# Altium schematic sheet Right_Power.SchDoc: Power Management (part 1 of 3)
size A4; Author: Parth Thakkar; CompanyName: Insane Corp; Organization: Low Self Esteam; Revision: v1.0; SheetNumber: 6; SheetTotal: 8
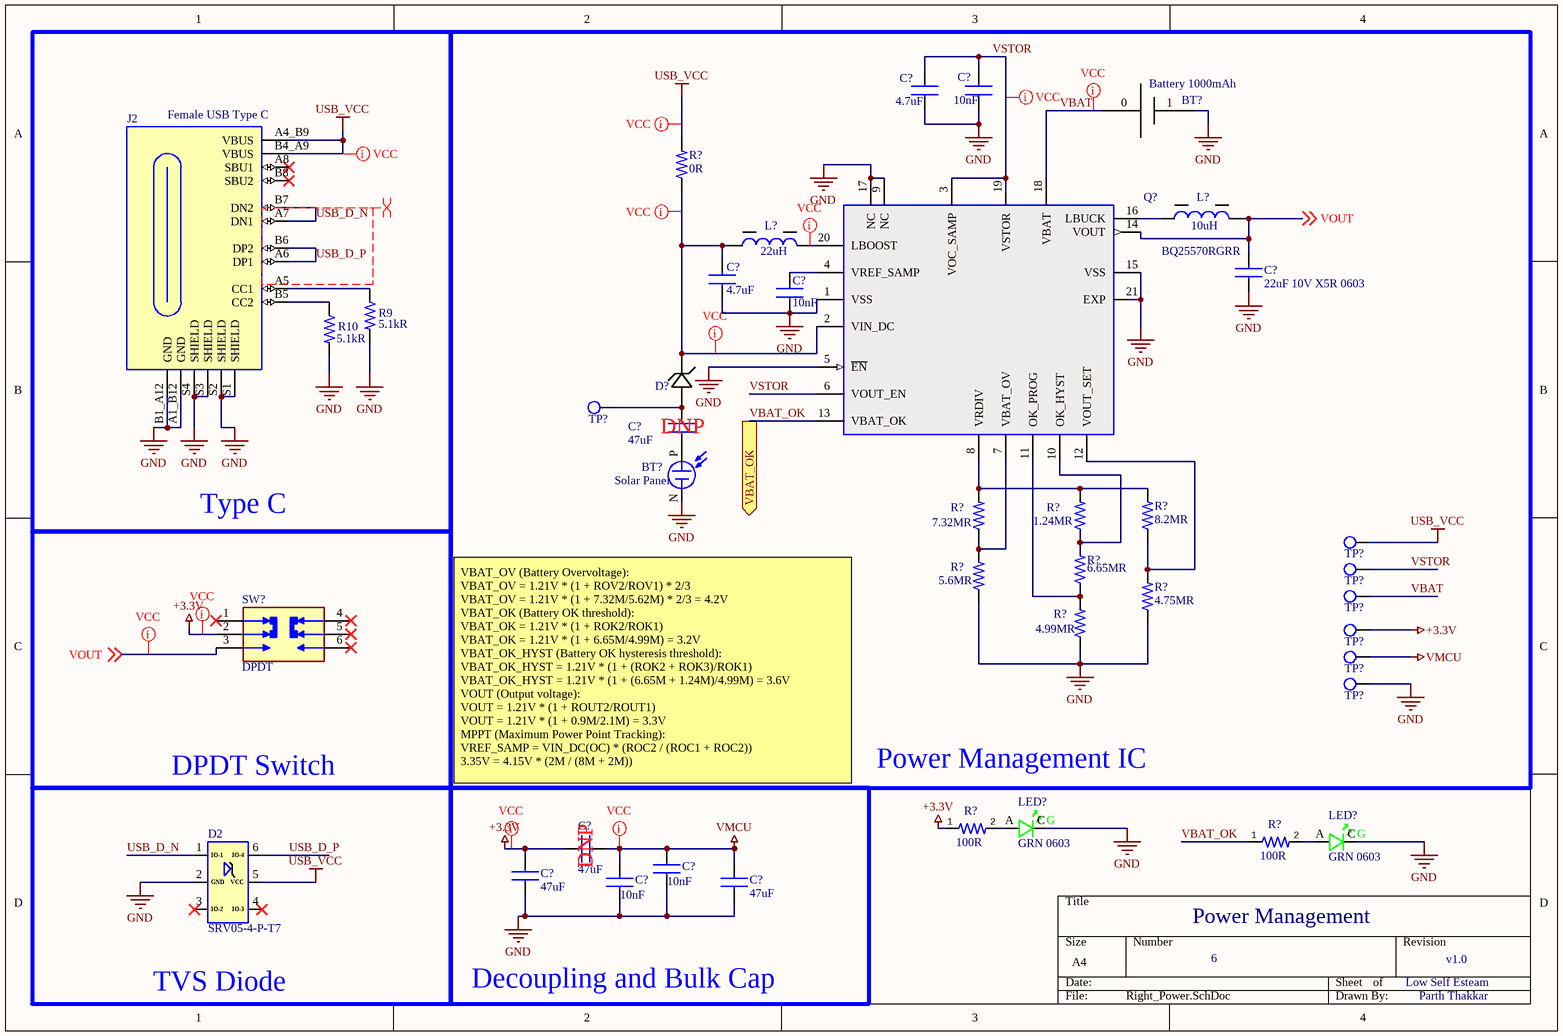
[diagram p0: Right_Power.SchDoc]

## Parts
(Parts that share a designator on the sheet are numbered #1, #2 ... from top to bottom, then left to right.)
BT?#1  Battery 1000mAh  [Battery]
BT?#2  Solar Panel  [Solar panel]
C?#1  value 4.7uF  [Capacitor 0603]  (hidden comment: CAP 4.7uF 25V 0603)
C?#2  value 10nF  [Capacitor 0603]  (hidden comment: CAP 10nF 100V 0603)
C?#3  22uF 10V X5R 0603  [Capacitor 0603]
C?#4  value 4.7uF  [Capacitor 0603]  (hidden comment: CAP 4.7uF 25V 0603)
C?#5  value 10nF  [Capacitor 0603]  (hidden comment: CAP 10nF 100V 0603)
C?#6  value 47uF  [CAPACITOR 0805]  (hidden comment: CAP 47uF 10V 0805)  (net tie, no BOM)
C?#7  value 47uF  [CAPACITOR 0805]  (hidden comment: CAP 47uF 10V 0805)  (net tie, no BOM)
C?#8  value 10nF  [Capacitor 0603]  (hidden comment: CAP 0.1uF 100V 0603)
C?#9  value 47uF  [Capacitor 0805]  (hidden comment: CAP 47uF 10V 0805)
C?#10  value 10nF  [Capacitor 0603]  (hidden comment: CAP 0.1uF 100V 0603)
C?#11  value 47uF  [Capacitor 0805]  (hidden comment: CAP 47uF 10V 0805)
D2  SRV05-4-P-T7  [TVS]
D?  Diode Schottky  [Diode Schottky]  (value not drawn)
J2  Female USB Type C  [Type C]
L?#1  Inductance-Nom (L): 10uH  [IND 10uH (1x3.2)]  (hidden comment: IND 10uH 1111)
L?#2  Inductance-Nom (L): 22uH  [IND 22uH (1.6x4.3)]  (hidden comment: IND 22uH 1515)
LED?#1  GRN 0603  [LED 0603]
LED?#2  GRN 0603  [LED 0603]
Q?  BQ25570RGRR  [BQ25570RGRR]
R9  value 5.1kR  [Resistor 0603]  (hidden comment: RES 5.1K 0603)
R10  value 5.1kR  [Resistor 0603]  (hidden comment: RES 5.1K 0603)
R?#1  value 0R  [Resistor 0402]  (hidden comment: RES 0R 0402)
R?#2  value 7.32MR  [Resistor 0603]  (hidden comment: RES 7.32M 0603)
R?#3  value 1.24MR  [Resistor 0603]  (hidden comment: RES 1.24M 0603)
R?#4  value 8.2MR  [Resistor 0603]  (hidden comment: RES 8.2M 0603)
R?#5  value 6.65MR  [Resistor 0603]  (hidden comment: RES 6.65M 0603)
R?#6  value 5.6MR  [Resistor 0603]  (hidden comment: RES 5.62M 0603)
R?#7  value 4.75MR  [Resistor 0603]  (hidden comment: RES 4.75M 0603)
R?#8  value 4.99MR  [Resistor 0603]  (hidden comment: RES 4.99M 0603)
R?#9  value 100R  [Resistor 0603]  (hidden comment: RES 100R 0603)
R?#10  value 100R  [Resistor 0603]  (hidden comment: RES 100R 0603)
SW?  DPDT  [DPDT]
TP?#1  Test Point  [Test point]  (value not drawn)  (no BOM)
TP?#2  Test point  [Test Point]  (value not drawn)  (no BOM)
TP?#3  Test point  [Test Point]  (value not drawn)  (no BOM)
TP?#4  Test point  [Test Point]  (value not drawn)  (no BOM)
TP?#5  Test point  [Test Point]  (value not drawn)  (no BOM)
TP?#6  Test point  [Test Point]  (value not drawn)  (no BOM)
TP?#7  Test point  [Test Point]  (value not drawn)  (no BOM)

## Blocks framed on the sheet
Type C: J2 R9 R10
Power Management IC: BT?#1 BT?#2 C?#1-C?#6 D? L?#1 L?#2 Q? R?#1-R?#8 TP?#1-TP?#7
Decoupling and Bulk Cap: C?#7-C?#11

## Ports
VBAT_OK (out, see 1[2C], 4[3B])

## Nets
+3.3V: C?#7.1 C?#9.1 R?#9.1 SW?.2 TP?#5.1
GND: BT?#1.1(GND) BT?#2.N C?#1.2 C?#2.2 C?#3.2 C?#4.2 C?#5.1 C?#8.2 C?#9.2 C?#10.2 C?#11.2 D2.2(GND) J2.A1_B12(GND) J2.B1_A12(GND) J2.S1(SHIELD) J2.S2(SHIELD) J2.S3(SHIELD) J2.S4(SHIELD) LED?#1.C LED?#2.C Q?.1(VSS) Q?.5(~{EN}) Q?.9(NC) Q?.15(VSS) Q?.17(NC) Q?.21(EXP) R9.2 R10.2 R?#6.1 R?#7.1 R?#8.1 TP?#7.1
USB_VCC: D2.5(VCC) J2.A4_B9(VBUS) J2.B4_A9(VBUS) R?#1.2 TP?#2.1
VMCU: C?#7.2 C?#8.1 C?#10.1 C?#11.1 TP?#6.1
USB_D_N: D2.1(IO-1) J2.A7(DN1) J2.B7(DN2)
USB_D_P: D2.6(IO-4) J2.A6(DP1) J2.B6(DP2)
VBAT: BT?#1.0(VCC) Q?.18(VBAT) TP?#4.1
VBAT_OK: Q?.13(VBAT_OK) R?#10.1 ; port VBAT_OK
VOUT: C?#3.1 L?#1.2 Q?.14(VOUT) SW?.3 ; off-sheet VOUT
VSTOR: C?#1.1 C?#2.1 Q?.3(VOC_SAMP) Q?.6(VOUT_EN) Q?.19(VSTOR) TP?#3.1
NetBT?#2_P: BT?#2.P C?#6.2
NetC?#4_1: C?#4.1 D?.1 L?#2.1 Q?.2(VIN_DC) R?#1.1
NetC?#5_2: C?#5.2 Q?.4(VREF_SAMP)
NetC?#6_1: C?#6.1 D?.2 TP?#1.1
NetJ2_A5: J2.A5(CC1) R9.1
NetJ2_B5: J2.B5(CC2) R10.1
NetL?#1_1: L?#1.1 Q?.16(LBUCK)
NetL?#2_2: L?#2.2 Q?.20(LBOOST)
NetLED?#1_A: LED?#1.A R?#9.2
NetLED?#2_A: LED?#2.A R?#10.2
NetQ?_7: Q?.7(VBAT_OV) R?#2.1 R?#6.2
NetQ?_8: Q?.8(VRDIV) R?#2.2 R?#3.2 R?#4.2
NetQ?_10: Q?.10(OK_HYST) R?#3.1 R?#5.2
NetQ?_11: Q?.11(OK_PROG) R?#5.1 R?#8.2
NetQ?_12: Q?.12(VOUT_SET) R?#4.1 R?#7.2

Not connected (* = marked no-connect by the designer): D2 3(IO-2)* 4(IO-3)*; J2 A8(SBU1)* B8(SBU2)*; SW? 1* 4* 5* 6*

## Layout directives
rule Width Constraint [Pref Width = 20mil    Min Width = 6mil    Max Width = 20mil]: +3.3V, NetC?#4_1, NetL?#2_2, USB_VCC, VBAT, VMCU, VOUT, VSTOR
differential pair: USB_D_N, USB_D_P

## Notes on the sheet
- (near C?#6) DNP
- DPDT Switch
- VBAT_OV (Battery Overvoltage):
  VBAT_OV = 1.21V * (1 + ROV2/ROV1) * 2/3
  VBAT_OV = 1.21V * (1 + 7.32M/5.62M) * 2/3 = 4.2V
  VBAT_OK (Battery OK threshold):
  VBAT_OK = 1.21V * (1 + ROK2/ROK1)
  VBAT_OK = 1.21V * (1 + 6.65M/4.99M) = 3.2V
  VBAT_OK_HYST (Battery OK hysteresis threshold):
  VBAT_OK_HYST = 1.21V * (1 + (ROK2 + ROK3)/ROK1)
  VBAT_OK_HYST = 1.21V * (1 + (6.65M + 1.24M)/4.99M) = 3.6V
  VOUT (Output voltage):
  VOUT = 1.21V * (1 + ROUT2/ROUT1)
  VOUT = 1.21V * (1 + 0.9M/2.1M) = 3.3V
  MPPT (Maximum Power Point Tracking):
  VREF_SAMP = VIN_DC(OC) * (ROC2 / (ROC1 + ROC2))
  3.35V = 4.15V * (2M / (8M + 2M))
- (near C?#7) DNP
- TVS Diode
- (in symbol LED Green 0603) G